# EasyEDA Pro project 示波器_V2.eprj, board PCB1
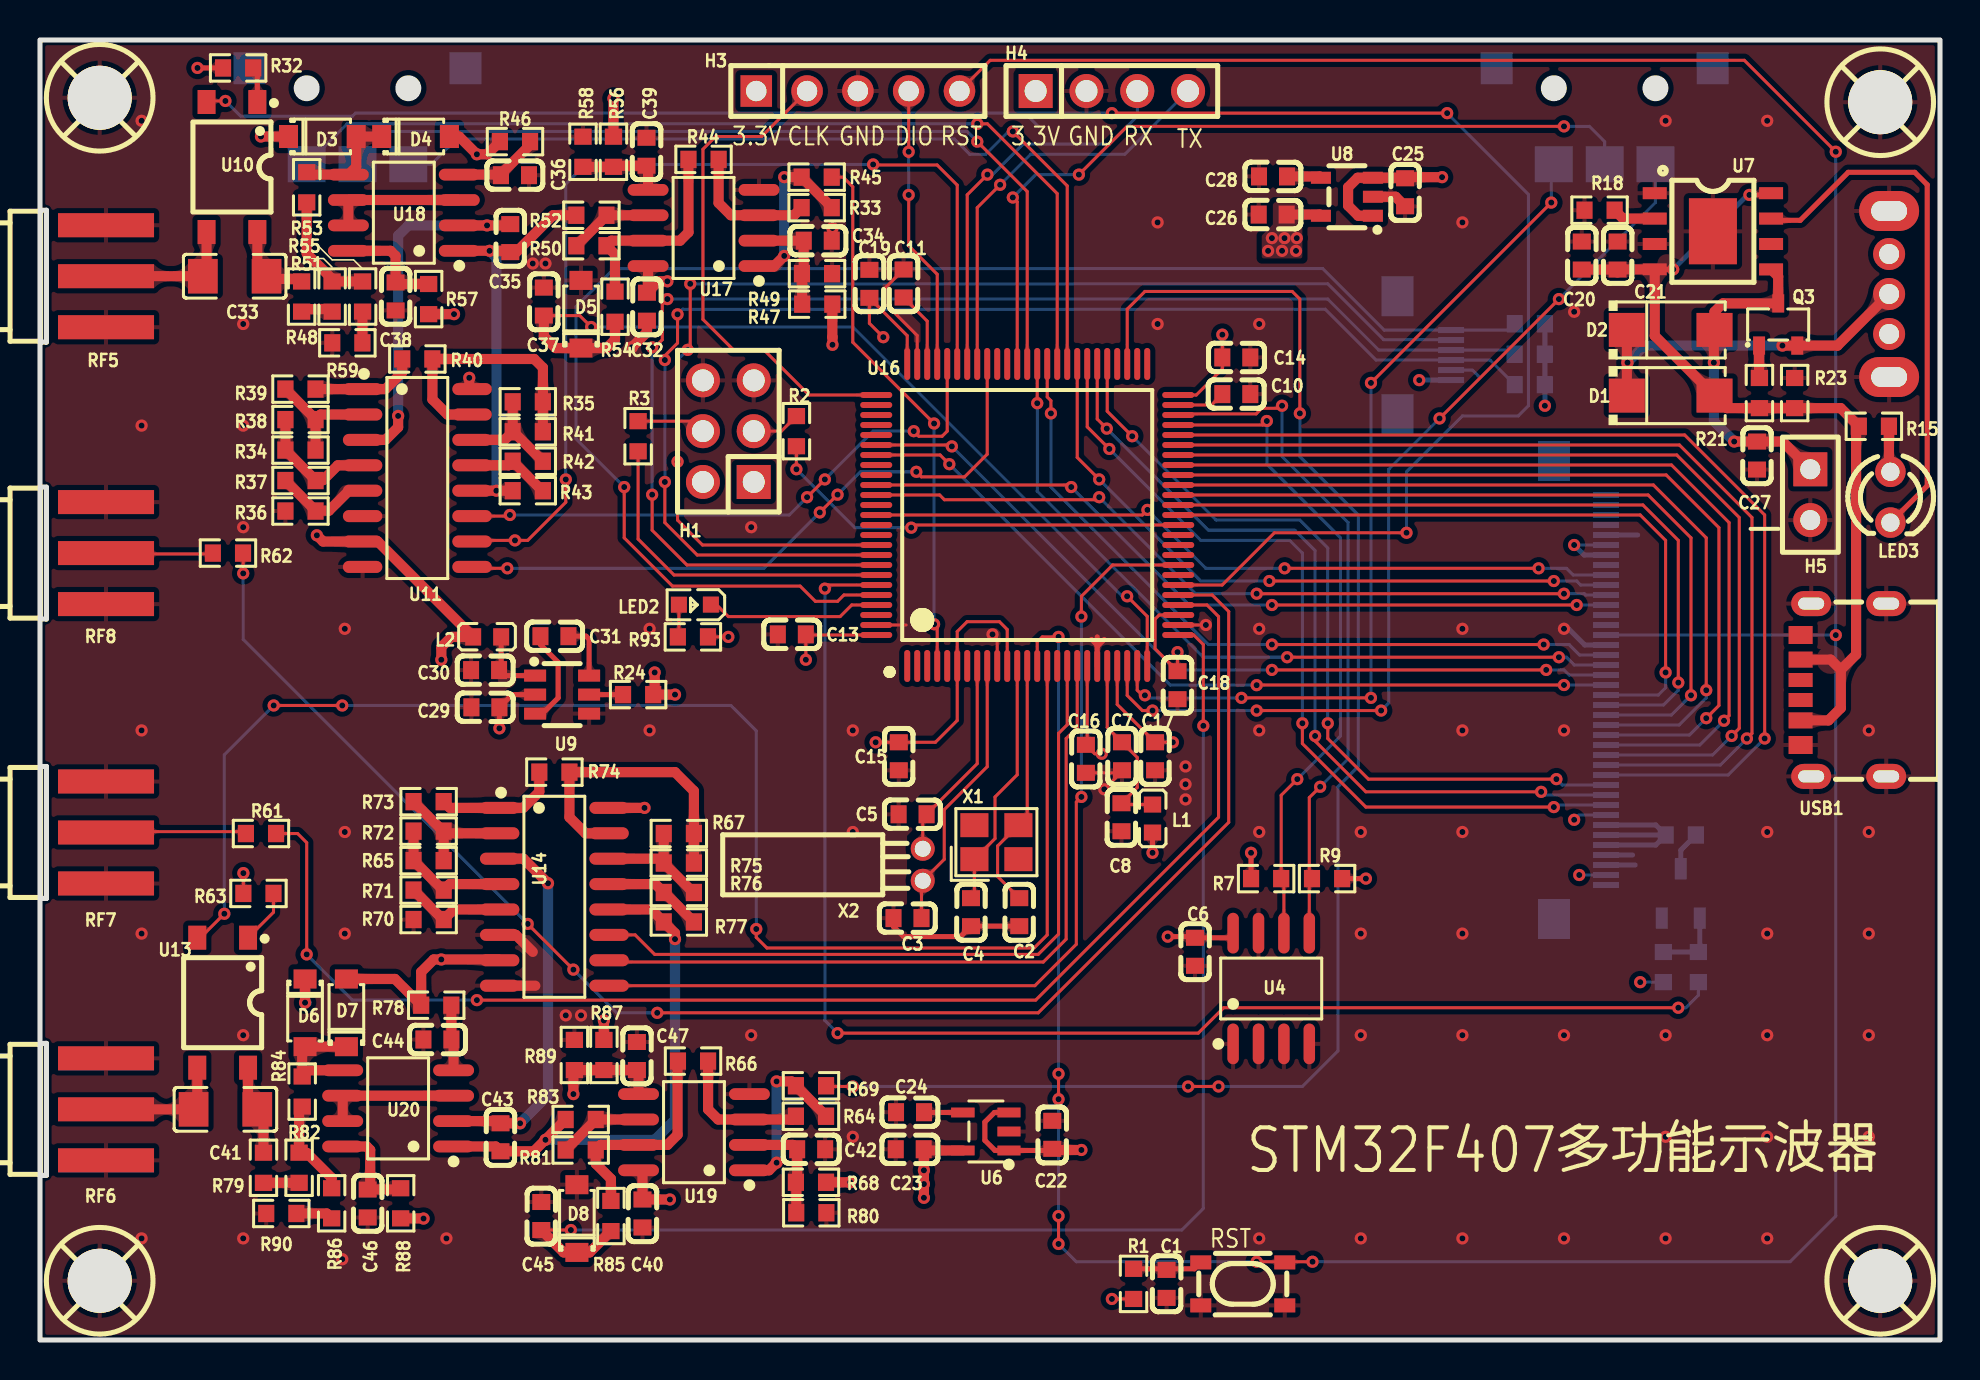
[diagram p4: board, top side]
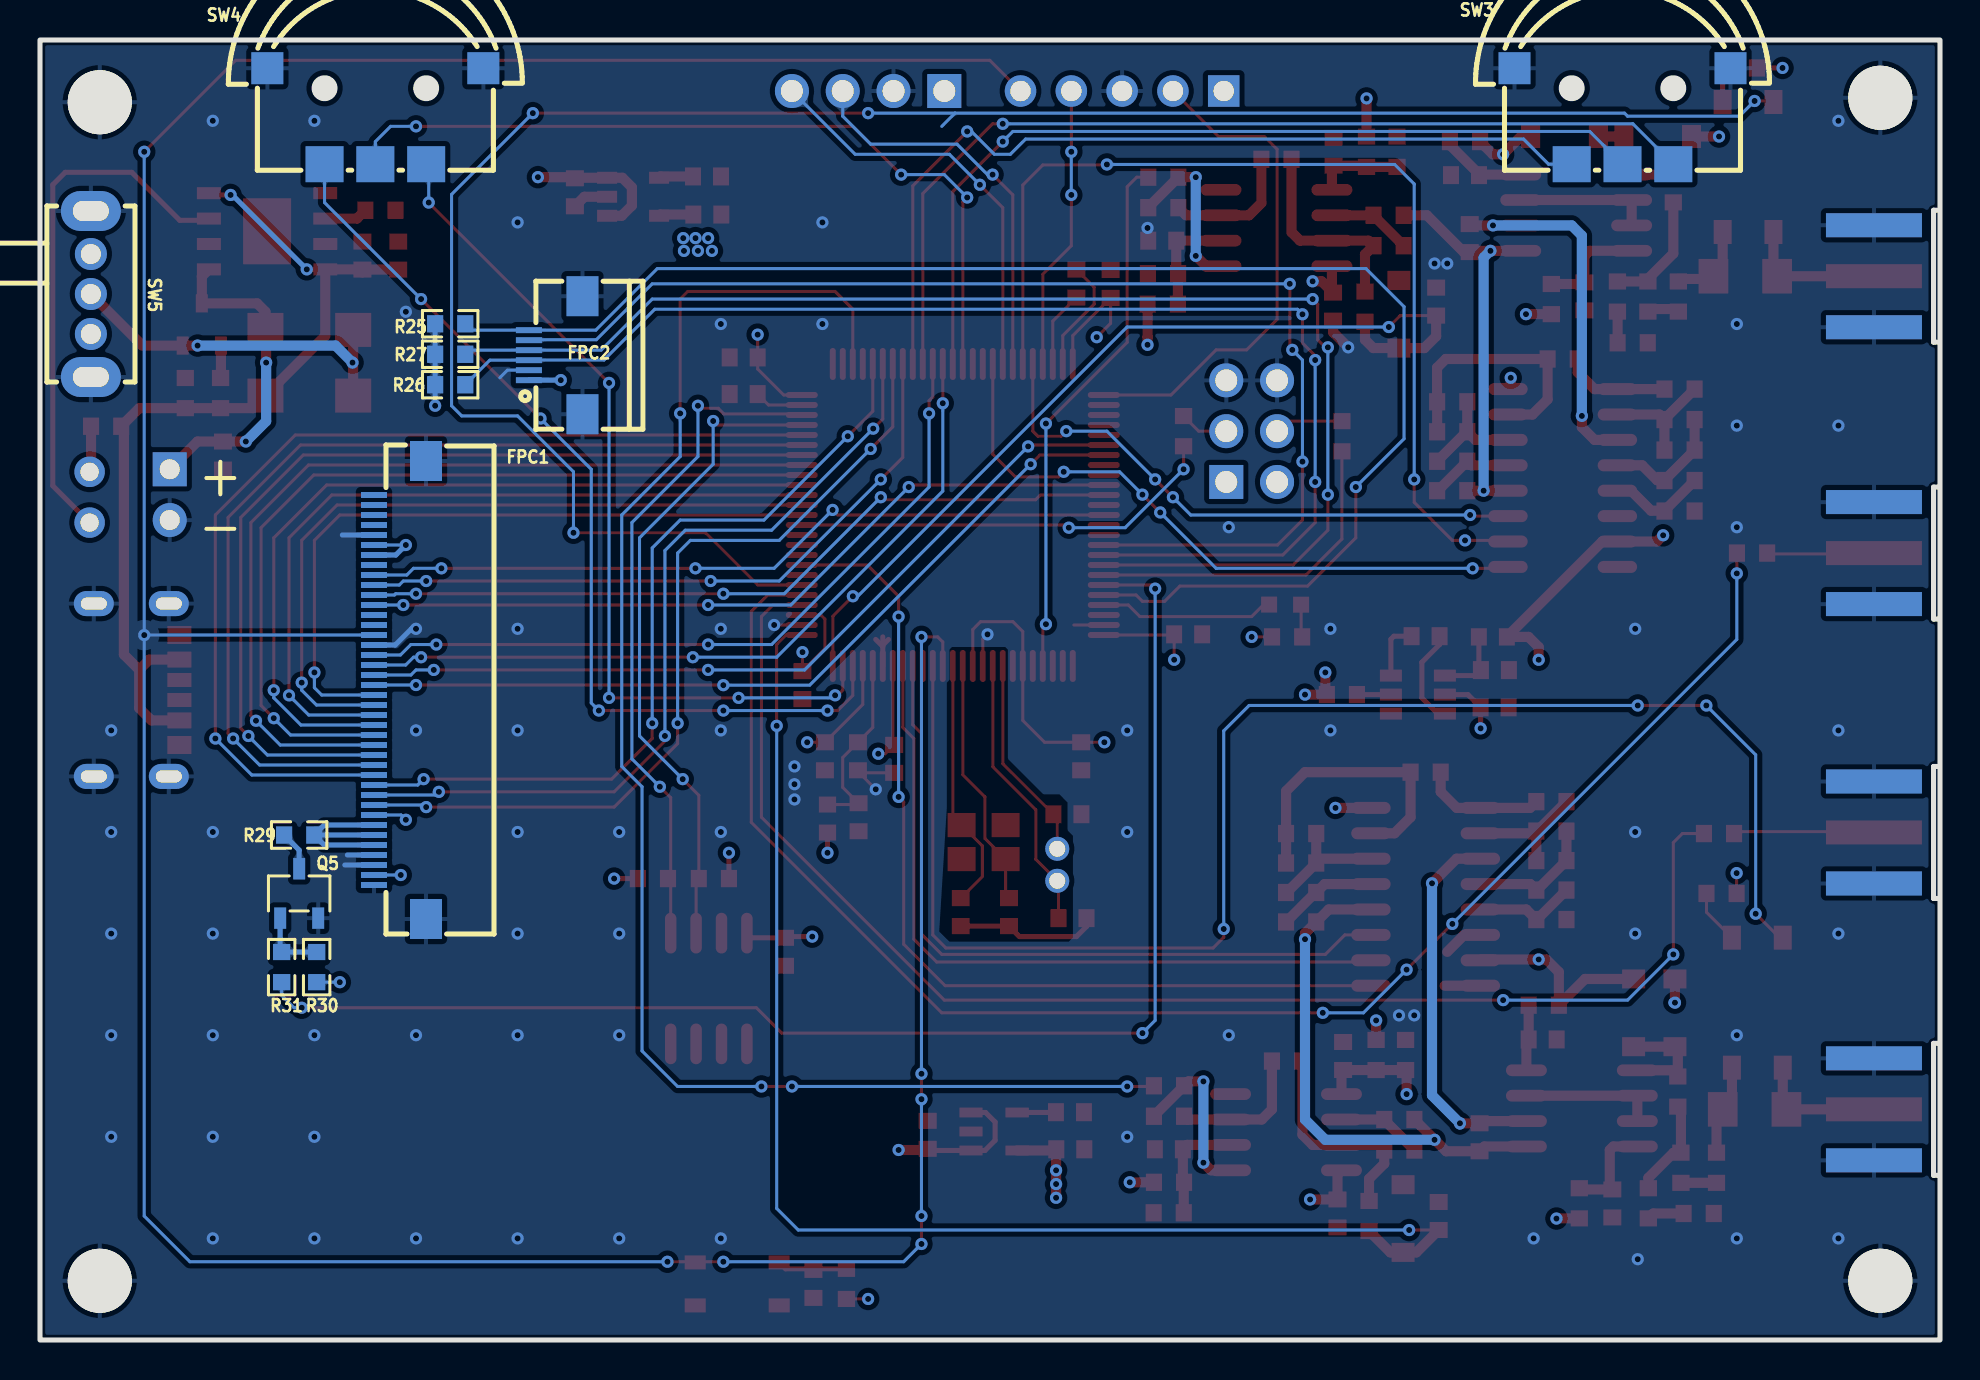
[diagram p5: board, bottom side, seen from below]

Outline 95 x 65 mm; copper layers: Top Layer, Inner1, Inner2, Bottom Layer. Coordinates in mm from the lower left corner of the outline.
Outline path: rectangle 0,65 95,0
Stack: Top Layer 0.035mm 外层铜厚1oz / Dielectric1 0.2104mm 7628 RC49% 8.6mil / Inner1 0.0152mm 内层铜厚 / Dielectric2 1.065mm 1.1mm H/HOZ 含铜 / Inner2 0.0152mm 内层铜厚 / Dielectric3 0.2104mm 7628 RC49% 8.6mil / Bottom Layer 0.035mm 外层铜厚1oz

## Design rules (mm)
spacing copperThickness1oz (default): track to track 0.102, other pairs 0.152 to 0.3
spacing copperThickness2oz: track to track 0.203, other pairs 0.152 to 0.3
spacing Plane_innerPlane: track to track 0.102, other pairs 0.152 to 0.3
spacing Copper_copperRegion: track to track 0.102, other pairs 0.152 to 0.3
spacing Copper_焊盘直接，增加过流能力: track to track 0.102, other pairs 0.152 to 0.3
track width copperThickness1oz (default): min 0.127, default 0.254, max 2.54
track width copperThickness2oz: min 0.203, default 0.254, max 2.54
differential pair differentialPair (default): width min 0.127, default 0.254, max 2.54; gap min 0.152, default 0.152
pour e1357 uses 焊盘直接，增加过流能力

## Placement (name value [footprint] x y rotation side)
C1  100nF  [C0603]  56.33 2.81 270 top
C2  20pF  [C0603]  48.96 21.39 90 top
C3  20pF  [C0603]  43.38 21.09 0 top
C4  20pF  [C0603]  46.55 21.39 90 top
C5  20pF  [C0603]  43.63 26.29 0 top
C6  100nF  [C0603]  57.75 19.41 270 top
C7  100nF  [C0603]  54.1 29.19 90 top
C8  100nF  [C0603]  54.07 26.14 90 top
C10  2.2uF  [C0603]  59.82 47.3 0 top
C11  2.2uF  [C0603]  43.18 52.82 90 top
C13  100nF  [C0603]  37.59 35.28 0 top
C14  100nF  [C0603]  59.82 49.13 180 top
C15  100nF  [C0603]  42.94 29.19 90 top
C16  100nF  [C0603]  52.29 29.06 90 top
C17  100nF  [C0603]  55.75 29.19 90 top
C18  100nF  [C0603]  56.88 32.74 90 top
C19  100nF  [C0603]  41.47 52.81 270 top
C20  10uF  [C0603]  77.09 54.22 270 top
C21  100nF  [C0603]  78.88 54.22 270 top
C22  1nF  [C0603]  50.61 10.26 90 top
C23  1nF  [C0603]  43.49 9.54 180 top
C24  22nF  [C0603]  43.5 11.39 0 top
C25  1uF  [C0603]  68.26 57.39 90 top
C26  1uF  [C0603]  61.63 56.27 180 top
C27  10uF  [C0603]  85.85 44.22 90 top
C28  10nF  [C0603]  61.65 58.18 0 top
C29  3.3uF  [C0603]  22.25 33.49 180 top
C30  3.3uF  [C0603]  22.27 31.63 0 top
C31  3.3uF  [C0603]  25.72 35.19 180 top
C32  100nF  [C0603]  30.35 51.67 90 top
C33  100nF  [C1206]  9.74 53.19 0 top
C34  100nF  [C0603]  38.89 54.97 180 top
C35  22pF  [C0603]  23.51 55.09 90 top
C36  100nF  [C0603]  23.75 58.24 0 top
C37  1nF  [C0603]  25.19 51.92 90 top
C38  100nF  [C0603]  17.78 52.18 270 top
C39  100nF  [C0603]  30.32 59.41 270 top
C40  100nF  [C0603]  30.12 6.33 90 top
C41  100nF  [C1206]  9.27 11.53 0 top
C42  100nF  [C0603]  38.56 9.54 180 top
C43  22pF  [C0603]  23.02 10.14 90 top
C44  100nF  [C0603]  19.87 15.03 180 top
C45  1nF  [C0603]  25.07 6.2 90 top
C46  100nF  [C0603]  16.38 6.83 270 top
C47  100nF  [C0603]  29.84 14.2 270 top
D1  1N5819  [SMA_L4.4-W2.6-LS5.0-RD]  81.53 47.22 0 top
D2  1N5819  [SMA_L4.4-W2.6-LS5.0-RD]  81.53 50.5 0 top
D3  1N4148W  [SOD-123_L2.8-W1.8-LS3.7-RD]  14.12 60.17 0 top
D4  1N4148W  [SOD-123_L2.8-W1.8-LS3.7-RD]  18.78 60.17 0 top
D5  1N4148W  [SOD-123_L2.8-W1.8-LS3.7-RD]  27.05 51.29 90 top
D6  1N4148W  [SOD-123_L2.8-W1.8-LS3.7-RD]  13.25 16.36 270 top
D7  1N4148W  [SOD-123_L2.8-W1.8-LS3.7-RD]  15.32 16.36 90 top
D8  1N4148W  [SOD-123_L2.8-W1.8-LS3.7-RD]  26.84 6.07 90 top
FPC1  AFC01-S40FCA-00  [FPC-SMD_P0.50-40P_FGS-XJ-H2.0]  77 32.5 270 bottom
FPC2  AFC01-S06FCA-00  [FPC-SMD_P0.50-6P_AFC01-S06FCA-00]  69.22 49.24 90 bottom
H1  PZ254V-12-6P  [HDR-TH_6P-P2.54-V-M-R2-C3-S2.54]  34.42 45.44 90 top
H3  -  [HDR-TH_5P-P2.54-V-F]  40.89 62.45 0 top
H4  -  [HDR-TH_4P-P2.54-V-F]  53.59 62.45 0 top
H5  -  [HDR-TH_2P-P2.54-V-F]  88.51 42.27 270 top
L1  GZ1608D601TF  [L0603]  55.63 26.07 270 top
L2  GZ1608D601TF  [L0603]  22.36 35.16 0 top
LED2  -  [LED_0603]  32.69 36.76 180 top
LED3  204-10SURD/S530-A3-L  [LED-TH_BD3.0-P2.54-FD]  92.52 42.14 270 top
Q3  AO3401  [SOT-23-3_L2.9-W1.4-P1.90-LS2.6-BR]  86.91 50.78 270 top
Q5  S8050  [SOT-23-3_L2.9-W1.6-P1.90-LS2.8-BR]  82.04 22.33 270 bottom
R1  10kΩ  [R0603]  54.68 2.81 270 top
R2  10kΩ  [R0603]  37.82 45.44 270 top
R3  10kΩ  [R0603]  29.91 45.19 90 top
R7  4.7kΩ  [R0603]  61.31 23.07 180 top
R9  4.7kΩ  [R0603]  64.35 23.07 0 top
R15  1K  [R0603]  91.69 45.69 180 top
R18  1.2K  [R0603]  77.98 56.49 0 top
R21  10K  [R0603]  85.97 47.35 90 top
R23  10K  [R0603]  87.73 47.35 270 top
R24  10K  [R0603]  29.91 32.27 0 top
R25  4.7kΩ  [R0603]  74.49 50.81 180 bottom
R26  4.7kΩ  [R0603]  74.49 47.76 0 bottom
R27  4.7kΩ  [R0603]  74.49 49.29 180 bottom
R29  10Ω  [R0603]  82.04 25.25 180 bottom
R30  10kΩ  [R0603]  81.17 18.64 270 bottom
R31  1kΩ  [R0603]  82.92 18.64 90 bottom
R32  1K  [R0603]  9.91 63.6 180 top
R33  100K  [R0603]  38.83 56.62 180 top
R34  120Ω  [R0603]  13.02 44.5 0 top
R35  1.2kΩ  [R0603]  24.39 46.91 180 top
R36  20Ω  [R0603]  13.02 41.45 0 top
R37  20Ω  [R0603]  13.02 42.97 0 top
R38  120Ω  [R0603]  13.02 46.02 0 top
R39  100Ω  [R0603]  13.02 47.54 0 top
R40  200Ω  [R0603]  18.87 49.05 0 top
R41  1.2kΩ  [R0603]  24.39 45.41 180 top
R42  1kΩ  [R0603]  24.39 43.94 180 top
R43  2kΩ  [R0603]  24.39 42.46 180 top
R44  1K  [R0603]  33.18 59.03 0 top
R45  200  [R0603]  38.83 58.14 0 top
R46  20Ω  [R0603]  23.75 59.92 0 top
R47  10K  [R0603]  38.86 51.79 0 top
R48  680kΩ  [R0603]  13.08 52.17 90 top
R49  10K  [R0603]  38.85 53.32 180 top
R50  2K  [R0603]  27.57 54.71 0 top
R51  300kΩ  [R0603]  14.61 52.17 270 top
R52  2K  [R0603]  27.57 56.24 0 top
R53  200Ω  [R0603]  13.33 57.63 90 top
R54  200Ω  [R0603]  28.75 51.67 270 top
R55  4K  [R0603]  16.13 52.17 90 top
R56  3kΩ  [R0603]  28.67 59.41 90 top
R57  20Ω  [R0603]  19.43 52.05 270 top
R58  1K  [R0603]  27.15 59.41 270 top
R59  16kΩ  [R0603]  15.37 49.86 0 top
R61  200Ω  [R0603]  11.05 25.32 0 top
R62  200Ω  [R0603]  9.4 39.35 0 top
R63  1K  [R0603]  10.92 22.33 180 top
R64  100K  [R0603]  38.55 11.19 180 top
R65  120Ω  [R0603]  19.43 23.97 0 top
R66  1K  [R0603]  32.65 13.95 0 top
R67  1.2kΩ  [R0603]  31.94 25.32 180 top
R68  10K  [R0603]  38.55 7.89 0 top
R69  200  [R0603]  38.55 12.71 0 top
R70  20Ω  [R0603]  19.43 21.02 0 top
R71  20Ω  [R0603]  19.43 22.5 0 top
R72  120Ω  [R0603]  19.43 25.44 0 top
R73  100Ω  [R0603]  19.43 26.92 0 top
R74  200Ω  [R0603]  25.72 28.39 0 top
R75  1.2kΩ  [R0603]  31.94 23.85 180 top
R76  1kΩ  [R0603]  31.94 22.38 180 top
R77  2kΩ  [R0603]  31.94 20.9 180 top
R78  20Ω  [R0603]  19.81 16.74 0 top
R79  680kΩ  [R0603]  11.17 8.61 90 top
R80  10K  [R0603]  38.56 6.36 180 top
R81  2K  [R0603]  27.03 9.5 0 top
R82  300kΩ  [R0603]  12.95 8.61 270 top
R83  2K  [R0603]  27.03 11.03 0 top
R84  200Ω  [R0603]  13.11 12.42 90 top
R85  200Ω  [R0603]  28.55 6.2 270 top
R86  4K  [R0603]  14.58 6.83 90 top
R87  3kΩ  [R0603]  28.19 14.25 90 top
R88  20Ω  [R0603]  18.03 6.83 270 top
R89  1K  [R0603]  26.72 14.25 270 top
R90  16kΩ  [R0603]  12.06 6.33 0 top
R93  200Ω  [R0603]  32.65 35.16 0 top
RF5  BWSMA-KE-P001  [SMA-SMD_BWSMA-KE-P001]  2.92 53.19 180 top
RF6  BWSMA-KE-P001  [SMA-SMD_BWSMA-KE-P001]  2.92 11.53 180 top
RF7  BWSMA-KE-P001  [SMA-SMD_BWSMA-KE-P001]  2.92 25.38 180 top
RF8  BWSMA-KE-P001  [SMA-SMD_BWSMA-KE-P001]  2.92 39.35 180 top
SW1  SKRPACE010  [KEY-SMD_4P-L4.2-W3.2-P2.20-LS4.6]  60.14 2.81 0 top
SW3  K1-1502SA-01  [KEY-SMD_K1-1502SA-01]  15.88 61.19 180 bottom
SW4  K1-1502SA-01  [KEY-SMD_K1-1502SA-01]  78.23 61.19 180 bottom
SW5  -  [拨动开关_侧]  92.46 52.3 270 bottom
TP1  -  [M3螺丝]  3.05 62.05 0 top
TP2  -  [M3螺丝]  3.05 2.9 0 top
TP3  -  [M3螺丝]  92.07 61.83 0 top
TP4  -  [M3螺丝]  92.07 2.9 0 top
U4  AT24C02  [SOP-8_L5.0-W4.0-P1.27-LS6.0-BL]  61.56 17.57 0 top
U6  RT9193-33GB  [SOT-23-5_L3.0-W1.7-P0.95-LS2.8-BL]  47.3 10.43 90 top
U7  TP4056  [ESOP-8_L4.9-W3.9-P1.27-LS6.0-BL-EP]  83.65 55.44 270 top
U8  RS3236-3.3YF5  [SOT-23-5_L3.0-W1.7-P0.95-LS2.8-BR]  65.35 57.16 0 top
U9  SGM3204YN6G/TR  [SOT-23-6_L2.9-W1.6-P0.95-LS2.8-BR]  26.11 32.27 180 top
U10  KAQY214STLD  [SOP-4_L3.9-W4.4-P2.54-LS7.0-BR]  9.6 58.65 90 top
U11  74HC4051D  [SOIC-16_L9.9-W3.9-P1.27-LS6.0-BL]  18.87 43.1 270 top
U13  KAQY214STLD  [SOP-4_L3.9-W4.4-P2.54-LS7.0-BR]  9.13 16.87 90 top
U14  74HC4051D  [SOIC-16_L9.9-W3.9-P1.27-LS6.0-BL]  25.72 22.16 270 top
U16  STM32F407VET6  [LQFP-100_L14.0-W14.0-P0.50-LS16.0-BL]  49.36 41.25 0 top
U17  TP2604-SR  [SOIC-8_L4.9-W3.9-P1.27-LS6.0-BL]  33.18 55.6 90 top
U18  TP2604-SR  [SOIC-8_L4.9-W3.9-P1.27-LS6.0-BL]  18.19 56.36 90 top
U19  TP2604-SR  [SOIC-8_L4.9-W3.9-P1.27-LS6.0-BL]  32.7 10.39 90 top
U20  TP2604-SR  [SOIC-8_L4.9-W3.9-P1.27-LS6.0-BL]  17.91 11.58 90 top
USB1  U262-061N-4BVC11  [USB-SMD_U262-061N-4BVC11]  90.17 32.5 90 top
X1  8MHz  [CRYSTAL-SMD_4P-L3.2-W2.5-BL]  47.82 24.89 0 top
X2  32.768kHz  [OSC-TH_BD3.1-P0.8-D0.3]  44.14 23.76 0 top

## Footprints (pads in the part's own frame, mm; a bottom-side part is the same pattern mirrored in y, then rotated)
C0603
  rect 0.8x0.9 smd: 1(-0.7,0) 2(0.7,0)
C1206
  rect 1.485x1.728 smd: 1(-1.593,0) 2(1.593,0)
CRYSTAL-SMD_4P-L3.2-W2.5-BL
  rect 1.4x1.2 smd: 1(-1.1,-0.85) 2(1.1,-0.85) 3(1.1,0.85) 4(-1.1,0.85)
ESOP-8_L4.9-W3.9-P1.27-LS6.0-BL-EP
  rect 0.6x1.2 smd: 1(-1.905,-2.909) 2(-0.635,-2.909) 3(0.635,-2.909) 4(1.905,-2.909) 5(1.905,2.909) 6(0.635,2.909) 7(-0.635,2.909) 8(-1.905,2.909)
  rect 3.3x2.4 smd: 9(0,0)
FPC-SMD_P0.50-6P_AFC01-S06FCA-00
  rect 0.3x1.3 smd: 1(-1.248,1.339) 2(-0.748,1.339) 3(-0.248,1.339) 4(0.252,1.339) 5(0.752,1.339) 6(1.252,1.339)
  rect 2x1.6 smd: 7(-2.95,-1.339) 8(2.95,-1.339)
FPC-SMD_P0.50-40P_FGS-XJ-H2.0
  rect 0.3x1.3 smd: 1(-9.75,-1.3) 2(-9.25,-1.3) 3(-8.75,-1.3) 4(-8.25,-1.3) 5(-7.75,-1.3) 6(-7.25,-1.3) 7(-6.75,-1.3) 8(-6.25,-1.3) 9(-5.75,-1.3) 10(-5.25,-1.3) 11(-4.75,-1.3) 12(-4.25,-1.3) 13(-3.75,-1.3) 14(-3.25,-1.3) 15(-2.75,-1.3) 16(-2.25,-1.3) 17(-1.75,-1.3) 18(-1.25,-1.3) 19(-0.75,-1.3) 20(-0.25,-1.3) 21(0.25,-1.3) 22(0.75,-1.3) 23(1.25,-1.3) 24(1.75,-1.3) 25(2.25,-1.3) 26(2.75,-1.3) 27(3.25,-1.3) 28(3.75,-1.3) 29(4.25,-1.3) 30(4.75,-1.3) 31(5.25,-1.3) 32(5.75,-1.3) 33(6.25,-1.3) 34(6.75,-1.3) 35(7.25,-1.3) 36(7.75,-1.3) 37(8.25,-1.3) 38(8.75,-1.3) 39(9.25,-1.3) 40(9.75,-1.3)
  rect 2x1.6 smd: 41(11.45,1.3) 42(-11.45,1.3)
HDR-TH_2P-P2.54-V-F
  rect 1.7x1.7 hole 1: 1(-1.27,0)
  round 1.7 hole 1: 2(1.27,0)
HDR-TH_4P-P2.54-V-F
  rect 1.7x1.7 hole 1.1: 1(-3.81,0)
  round 1.7 hole 1.1: 2(-1.27,0) 3(1.27,0) 4(3.81,0)
HDR-TH_5P-P2.54-V-F
  rect 1.575x1.575 hole 1.02: 1(-5.08,0)
  round 1.575 hole 1.02: 2(-2.54,0) 3(0,0) 4(2.54,0) 5(5.08,0)
HDR-TH_6P-P2.54-V-M-R2-C3-S2.54
  rect 1.7x1.7 hole 1.1: 1(-2.54,-1.27)
  round 1.7 hole 1.1: 2(-2.54,1.27) 3(0,-1.27) 4(0,1.27) 5(2.54,-1.27) 6(2.54,1.27)
KEY-SMD_4P-L4.2-W3.2-P2.20-LS4.6
  rect 1.05x0.7 smd: 1(-2.1,1.075) 2(2.1,1.075) 3(-2.1,-1.075) 4(2.1,-1.075)
KEY-SMD_K1-1502SA-01
  rect 1.9x1.8 smd: 1(-2.54,-2.4) 2(2.54,-2.4) T(0,-2.4)
  rect 1.6x1.6 smd: 5(-5.4,2.4) C(5.4,2.4)
L0603
  rect 0.8x0.864 smd: 1(-0.7,0) 2(0.7,0)
LED-TH_BD3.0-P2.54-FD
  round 1.524 hole 0.914: 1(-1.27,0) 2(1.27,0)
LED_0603
  rect 0.8x0.8 smd: 1(-0.851,-0.01) 2(0.75,-0.005)
LQFP-100_L14.0-W14.0-P0.50-LS16.0-BL
  oval 0.3x1.6 smd: 1(-6,-7.55) 2(-5.5,-7.55) 3(-5,-7.55) 4(-4.5,-7.55) 5(-4,-7.55) 6(-3.5,-7.55) 7(-3,-7.55) 8(-2.5,-7.55) 9(-2,-7.55) 10(-1.5,-7.55) 11(-1,-7.55) 12(-0.5,-7.55) 13(0,-7.55) 14(0.5,-7.55) 15(1,-7.55) 16(1.5,-7.55) 17(2,-7.55) 18(2.5,-7.55) 19(3,-7.55) 20(3.5,-7.55) 21(4,-7.55) 22(4.5,-7.55) 23(5,-7.55) 24(5.5,-7.55) 25(6,-7.55) 51(6,7.55) 52(5.5,7.55) 53(5,7.55) 54(4.5,7.55) 55(4,7.55) 56(3.5,7.55) 57(3,7.55) 58(2.5,7.55) 59(2,7.55) 60(1.5,7.55) 61(1,7.55) 62(0.5,7.55) 63(0,7.55) 64(-0.5,7.55) 65(-1,7.55) 66(-1.5,7.55) 67(-2,7.55) 68(-2.5,7.55) 69(-3,7.55) 70(-3.5,7.55) 71(-4,7.55) 72(-4.5,7.55) 73(-5,7.55) 74(-5.5,7.55) 75(-6,7.55)
  oval 1.6x0.3 smd: 26(7.55,-6) 27(7.55,-5.5) 28(7.55,-5) 29(7.55,-4.5) 30(7.55,-4) 31(7.55,-3.5) 32(7.55,-3) 33(7.55,-2.5) 34(7.55,-2) 35(7.55,-1.5) 36(7.55,-1) 37(7.55,-0.5) 38(7.55,0) 39(7.55,0.5) 40(7.55,1) 41(7.55,1.5) 42(7.55,2) 43(7.55,2.5) 44(7.55,3) 45(7.55,3.5) 46(7.55,4) 47(7.55,4.5) 48(7.55,5) 49(7.55,5.5) 50(7.55,6) 76(-7.55,6) 77(-7.55,5.5) 78(-7.55,5) 79(-7.55,4.5) 80(-7.55,4) 81(-7.55,3.5) 82(-7.55,3) 83(-7.55,2.5) 84(-7.55,2) 85(-7.55,1.5) 86(-7.55,1) 87(-7.55,0.5) 88(-7.55,0) 89(-7.55,-0.5) 90(-7.55,-1) 91(-7.55,-1.5) 92(-7.55,-2) 93(-7.55,-2.5) 94(-7.55,-3) 95(-7.55,-3.5) 96(-7.55,-4) 97(-7.55,-4.5) 98(-7.55,-5) 99(-7.55,-5.5) 100(-7.55,-6)
M3螺丝
  round 3.2 hole 3.2: 1(-0.064,0.064)
OSC-TH_BD3.1-P0.8-D0.3
  round 1.2 hole 0.8: 1(0,0.8) 2(0,-0.8)
R0603
  rect 0.806x0.864 smd: 1(-0.753,0) 2(0.753,0)
SMA-SMD_BWSMA-KE-P001
  rect 4.8x1.2 smd: 1(-0.381,-2.55) 2(-0.381,2.55) 5(-0.381,0)
  rect 4.8x1.2 smd far side: 3(-0.381,2.55) 4(-0.381,-2.55)
SMA_L4.4-W2.6-LS5.0-RD
  rect 1.8x1.7 smd: 1(-2.192,0) 2(2.192,0)
SOD-123_L2.8-W1.8-LS3.7-RD
  rect 0.95x1.15 smd: 1(-1.692,0) 2(1.692,0)
SOIC-8_L4.9-W3.9-P1.27-LS6.0-BL
  oval 0.588x2.045 smd: 1(-1.905,-2.772) 2(-0.635,-2.772) 3(0.635,-2.772) 4(1.905,-2.772) 5(1.905,2.772) 6(0.635,2.772) 7(-0.635,2.772) 8(-1.905,2.772)
SOIC-16_L9.9-W3.9-P1.27-LS6.0-BL
  oval 0.602x1.971 smd: 1(-4.445,-2.736) 2(-3.175,-2.736) 3(-1.905,-2.736) 4(-0.635,-2.736) 5(0.635,-2.736) 6(1.905,-2.736) 7(3.175,-2.736) 8(4.445,-2.736) 9(4.445,2.736) 10(3.175,2.736) 11(1.905,2.736) 12(0.635,2.736) 13(-0.635,2.736) 14(-1.905,2.736) 15(-3.175,2.736) 16(-4.445,2.736)
SOP-4_L3.9-W4.4-P2.54-LS7.0-BR
  rect 1.199x0.9 smd: 1(3.25,-1.27) 2(3.25,1.27) 3(-3.25,1.27) 4(-3.25,-1.27)
SOP-8_L5.0-W4.0-P1.27-LS6.0-BL
  oval 0.574x2.035 smd: 1(-1.905,-2.768) 2(-0.635,-2.768) 3(0.635,-2.768) 4(1.905,-2.768) 5(1.905,2.768) 6(0.635,2.768) 7(-0.635,2.768) 8(-1.905,2.768)
SOT-23-3_L2.9-W1.4-P1.90-LS2.6-BR
  rect 0.91x0.6 smd: 1(1.055,-0.955) 2(1.055,0.955) 3(-1.055,0)
SOT-23-3_L2.9-W1.6-P1.90-LS2.8-BR
  rect 1.07x0.6 smd: 1(1.235,-0.95) 2(1.235,0.95) 3(-1.235,0)
SOT-23-5_L3.0-W1.7-P0.95-LS2.8-BL
  rect 0.49x1.157 smd: 1(-0.95,-1.153) 2(0,-1.153) 3(0.95,-1.153)
  rect 0.49x1.175 smd: 4(0.95,1.153) 5(-0.95,1.153)
SOT-23-5_L3.0-W1.7-P0.95-LS2.8-BR
  rect 1x0.6 smd: 1(1.3,-0.95) 2(1.3,0) 3(1.3,0.95) 4(-1.3,0.95) 5(-1.3,-0.95)
SOT-23-6_L2.9-W1.6-P0.95-LS2.8-BR
  rect 1.1x0.6 smd: 1(1.35,-0.95) 2(1.35,0) 3(1.35,0.95) 4(-1.35,0.95) 5(-1.35,0) 6(-1.35,-0.95)
USB-SMD_U262-061N-4BVC11
  oval 1.25x2 hole 0.6x1.3: 7(-4.32,1.611) 8(4.32,1.611) 9(-4.32,-2.139) 10(4.32,-2.139)
  rect 0.7x1.2 smd: A5(-0.5,2.139) B5(0.5,2.139)
  rect 0.8x1.2 smd: A9(1.52,2.139) B9(-1.52,2.139)
  rect 0.9x1.2 smd: A12(2.75,2.139) B12(-2.75,2.139)
拨动开关_侧
  oval 1.6x1.6 hole 1.001: 1(-1.999,0) 2(0,0) 3(1.999,0)
  oval 1.999x2.999 hole 1.001x1.801: 4(4.151,0) 5(-4.151,0)

## Nets
As in the schematic.

Pads without a net: FPC1 1 2 3 4 8 13 14; SW5 1; U7 6; U16 1 2 3 5 7 16 32 34 35 36 51 52 54 65 66 77 78 79 80 83 84 87 89 90 98; USB1 A5 B5; X1 2 4

## Via types
v1: diameter 0.61, hole 0.305, Top Layer to Bottom Layer, 269 vias

## Routing (per net, layer and track width the routed paths; a pad name or vN(x,y) marks a point on that pad's centre or on a via; arc(x,y) is an arc through that point)
+3.3V: length 63.6
  Top Layer w0.152: 41.81,35.25 38.32,35.25 C13.2 v1(38.29,34.01) ; U16.75 43.36,50.22 C19.2 41.47,50.83 v1(42.16,50.14) ; 48.36,33.7 48.36,35.52 47.97,35.92 46.35,35.92 45.86,35.42 45.86,30.98 44.77,29.89 C15.2 v1(41.78,29.89) ; v1(53.09,29.31) 52.74,29.31 C16.2 52.36,29.83 52.36,33.7 ; v1(56.88,34.39) C18.2 55.75,34.57 55.75,36.04 55.96,36.25 U16.28 ; U16.50 57.82,47.25 59.12,48.55 v1(59.12,50.27) ; v1(80.01,17.89) 80.01,17.88 ; R93.2 v1(34.42,35.16) ; R1.2 v1(53.59,2.05)
  Top Layer w0.254: v1(56.39,20.17) 57.69,20.17 C6.1 59.42,20.11 U4.8 ; L1.2 v1(55.63,24.36) ; R9.2 v1(66.29,23.07) ; R7.2 v1(60.55,24.36)
  Top Layer w0.508: 62.34,56.27 63.99,56.27 U8.5
  Bottom Layer w0.152: v1(38.29,34.01) 38.23,34.01 ; FPC1.39 v1(76.96,23.25) ; FPC1.33 76.95,26.25 v1(76.71,26.01) ; R30.2 v1(80.01,17.89) ; FPC1.6 v1(76.71,39.75)
  Bottom Layer w0.254: FPC2.1 v1(68.96,47.99) ; v1(76.71,39.75) 77.21,39.25 FPC1.7 ; v1(75.24,46.71) R26.2 R27.1 R25.1 ; v1(66.29,23.07) 66.29,23.09
  vias: v1(61.4,54.46) v1(61.59,55.09) v1(62.1,54.46) v1(62.23,55.09) v1(62.84,55.09) v1(62.8,54.46)
+3.3V_A: length 63.1
  Top Layer w0.152: 53.86,33.7 53.86,31.78 C17.2 v1(56.64,29.89) ; R63.2 v1(10.17,23.34)
  Top Layer w0.254: v1(22.97,30.58) C30.2 23.6,32.27 U9.2 ; R32.2 v1(7.87,63.6)
  Top Layer w0.508: v1(31.37,52.94) 30.92,52.94 30.4,52.42 ; v1(44.2,7.11) v1(44.2,7.8) v1(44.2,8.48) 44.2,9.53 ; C23.1 44.2,9.53 ; 44.2,9.53 44.25,9.48 U6.5 ; U19.8 30.12,8.29 C40.2 v1(31.5,7.03) ; R56.2 v1(28.67,62.08) ; v1(39.62,49.76) 39.62,50.14 39.62,50.15 R47.2 ; U11.16 21.46,47.68 v1(21.46,48.11) ; 30.4,52.42 U17.8 ; 30.4,52.42 30.35,52.36 ; R68.2 v1(40.51,7.89) ; v1(19.18,6.07) 19.17,6.08 R88.2 ; U14.16 v1(30.23,26.61) ; R57.2 v1(20.7,51.29) ; v1(31.75,32.27) R24.2 30.73,32.34 v1(30.73,33.38) ; D6.1 v1(13.25,16.87) ; D3.1 v1(11.05,60.17) ; R87.2 v1(28.19,15.98)
  Inner2 w0.152: v1(56.64,29.89) 56.64,23.72 44.2,11.28 v1(44.2,8.48)
  Bottom Layer w0.254: v1(22.97,30.58) 22.99,30.58
  Bottom Layer w0.508: v1(13.25,16.87) 13.33,16.87
-3.3V: length 63
  Top Layer w0.508: U14.7 22.94,19.03 v1(20.07,19.03) 19.69,19.03 19.06,18.4 R78.1 17.75,18.05 D7.2 ; v1(20.07,34.01) 20.07,34.65 20.57,35.16 L2.1 16.89,39.92 U11.7 14.15,39.92 v1(13.84,40.23) ; R46.1 22.36,59.28 v1(21.84,59.28) 20.95,60.17 D4.2
  Inner2 w0.508: v1(13.84,40.23) 13.84,48.74 21.84,56.75 v1(21.84,59.28) ; v1(20.07,19.03) v1(20.07,34.01)
GND: length 39.3
  Top Layer w0.152: v1(47.62,35.28) 47.86,35.05 47.86,33.7 ; v1(58.29,35.75) U16.27 ; 41.81,35.75 43.31,35.75 ; C11.2 42.29,52.63 42.29,51.79 43.86,50.22 U16.74 ; C16.1 53.97,28.36 C7.1 54.1,28.42 v1(53.21,27.53)
  Top Layer w0.254: 52.86,34.75 52.86,35.16 ; 52.86,34.75 52.58,35.03 ; 52.86,34.75 52.86,34.68 ; 52.86,34.68 53.21,35.03 ; 52.86,34.68 52.86,33.7 ; C3.1 42.68,20.67 43.18,20.17 46.03,20.17 C4.1 C2.1
  Top Layer w0.508: v1(29.59,49.63) 30.35,50.39 C32.1 ; C25.1 67.78,57.16 U8.2 ; U14.6 23.79,20.26 24.64,19.41 ; U14.8 24.77,17.72 ; C34.1 39.62,55 v1(39.62,55.6)
  Bottom Layer w0.152: 72.01,48.11 71.62,48.49 FPC2.2
  Bottom Layer w0.254: FPC1.37 79.63,24.25 ; FPC1.16 77.24,34.75 76.43,35.56 v1(76.2,35.56) ; FPC1.38 79.76,23.75 ; FPC1.5 79.88,40.25
  vias: v1(5.08,60.96) v1(5.08,45.72) v1(5.08,30.48) v1(5.08,20.32) v1(5.08,5.08) v1(10.16,50.8) v1(10.16,45.72) v1(10.16,40.64) v1(10.16,15.24) v1(10.16,5.08) v1(15.11,4.04) v1(15.24,35.56) v1(15.24,25.4) v1(15.24,20.32) v1(20.32,5.08) v1(24.64,53.82) v1(25.27,53.82) v1(26.29,16.23) v1(27.05,16.23) v1(30.48,35.56) v1(30.48,30.48) v1(35.56,40.64) v1(35.56,15.24) v1(40.64,30.48) v1(40.64,25.4) v1(40.64,10.16) v1(55.88,55.88) v1(55.88,50.8) v1(57.28,28.68) v1(57.28,27.79) v1(57.28,27.03) v1(60.96,50.8) v1(60.96,35.56) v1(60.96,30.48) v1(60.96,25.4) v1(60.96,5.08) v1(66.04,25.4) v1(66.04,20.32) v1(66.04,15.24) v1(66.04,5.08) v1(71.12,55.88) v1(71.12,35.56) v1(71.12,30.48) v1(71.12,25.4) v1(71.12,20.32) v1(71.12,15.24) v1(71.12,5.08) v1(76.2,30.48) v1(76.2,15.24) v1(76.2,5.08) v1(76.71,51.41) v1(81.28,60.96) v1(81.28,15.24) v1(81.28,10.16) v1(81.28,5.08) v1(86.36,60.96) v1(86.36,25.4) v1(86.36,20.32) v1(86.36,15.24) v1(86.36,10.16) v1(86.36,5.08) v1(91.44,30.48) v1(91.44,25.4) v1(91.44,20.32) v1(91.44,15.24) v1(91.44,10.16)
VBUS: length 45.5
  Top Layer w0.254: 86.55,57.34 86.47,57.25 v1(85.47,57.25) ; U7.4 v1(81.66,53.53)
  Top Layer w0.508: C20.2 78.74,53.52 78.88,53.38 ; 88.03,34.02 89.53,34.02 90.04,33.51 ; 90.04,33.51 90.81,34.27 90.81,45.55 R15.2 90.03,46.59 R23.2 R21.1 84.35,46.59 D1.2 80.74,50.21 U7.4 78.89,53.53 C21.2 ; 90.04,33.51 90.04,31.6 89.42,30.98 88.03,30.98
  Bottom Layer w0.254: v1(85.47,57.25) 85.38,57.25 v1(81.66,53.53)
VCC_IN: length 17.8
  Top Layer w0.508: 79.34,48.87 79.37,48.87 v1(79.38,48.87) ; 79.34,48.87 D1.1 ; 79.34,48.87 D2.1 ; SW5.2 89.88,49.72 Q3.2 v1(87.12,49.72)
  Bottom Layer w0.508: v1(79.38,48.87) 80.22,49.72 v1(87.12,49.72)
VCC_OUT: length 113.4
  Top Layer w0.254: U6.3 47.72,11.38 47.24,10.9 47.24,9.98 47.75,9.48 U6.1 50.53,9.48 C22.1
  Top Layer w0.508: v1(70.1,58.14) 68.31,58.14 C25.2 68.23,58.11 U8.3 65.88,58.11 65.41,57.63 65.41,56.72 65.91,56.21 U8.1 ; C22.1 50.67,9.5 v1(52.07,9.5)
  Inner2 w0.508: v1(70.1,58.14) 73.15,55.09 87.66,55.09 SW5.3 89.31,50.3 86.11,47.09 86.11,41.25 78.49,33.63 78.49,12.55 75.44,9.5 v1(52.07,9.5)
$C1_1: length 3.6
  Top Layer w0.254: 56.28,3.56 C1.1 ; 56.28,3.56 57.72,3.56 SW1.1 ; 56.28,3.56 R1.1
$C7_2: length 9.4
  Top Layer w0.152: 53.36,33.7 53.36,30.63 C7.2 54.86,29.12 54.86,27.63 C8.2 54.14,26.77 L1.1
$C10_1: length 2.4
  Top Layer w0.152: 59.12,47.3 58.57,46.75 U16.49
$C11_1: length 3.8
  Top Layer w0.152: C11.1 44.36,50.94 U16.73
$C24_2: length 1.9
  Top Layer w0.254: U6.4 44.22,11.38 C24.2
$C27_2: length 16.5
  Top Layer w0.508: v1(83.69,48.87) 83.69,50.47 D2.2 83.73,51.41 84.15,51.83 Q3.3 86.91,53.18 U7.5 ; v1(84.71,44.92) C27.2 87.13,44.92 H5.1
  Bottom Layer w0.508: v1(84.71,44.92) 83.69,45.94 v1(83.69,48.87)
$C28_2: length 1.7
  Top Layer w0.508: C28.2 63.98,58.18 U8.4
$C29_1: length 3.6
  Top Layer w0.254: L2.2 23.06,33.6 C29.1 23.23,33.22 U9.1
$C31_1: length 2.9
  Top Layer w0.254: C31.1 27.31,35.19 27.45,35.04 U9.6
$C31_2: length 4.9
  Top Layer w0.254: C31.2 25.02,34.77 25.91,33.89 25.91,32.11 25.12,31.32 U9.3
$C33_1: length 5.7
  Top Layer w0.508: 4.7,53.19 C33.1 8.33,53.37 U10.3
$C33_2: length 4.2
  Top Layer w0.508: U10.4 10.87,53.65 C33.2 11.46,53.05 13.08,53.05
$C34_2: length 5.5
  Top Layer w0.508: 38.11,53.33 R49.2 ; 38.11,53.33 38.19,53.41 C34.2 35.95,54.97 ; 38.11,53.33 R47.1
$C36_1: length 4.4
  Top Layer w0.508: R46.2 24.5,59.75 23.02,58.27 ; U18.4 23.02,58.27 ; 23.02,58.27 C36.1
$C38_1: length 5.5
  Top Layer w0.508: R57.1 17.86,52.8 C38.1 17.78,54.2 17.53,54.46 U18.8
$C39_2: length 4.4
  Top Layer w0.508: R58.2 R56.1 28.73,58.71 C39.2 30.4,58.63 U17.5
$C41_1: length 5.1
  Top Layer w0.508: U13.3 7.86,11.72 C41.1 4.7,11.53
$C41_2: length 4.6
  Top Layer w0.508: R79.2 11.17,11.22 C41.2 10.4,11.99 U13.4
$C42_2: length 5.7
  Top Layer w0.508: 37.81,7.9 R68.1 ; 37.81,7.9 37.86,7.95 C42.2 37.64,9.75 U19.2 ; 37.81,7.9 R80.2
$C44_1: length 3.3
  Top Layer w0.508: R78.2 20.57,16.74 C44.1 20.68,14.91 U20.4
$C46_1: length 5.2
  Top Layer w0.508: U20.8 16.34,9.68 16.51,9.5 16.51,7.65 C46.1 17.97,7.53 R88.1
$C47_2: length 5.6
  Top Layer w0.508: 29.85,13.5 R87.1 R89.2 26.67,13.45 v1(26.67,12.3) ; 29.85,13.5 29.93,13.42 U19.5 ; 29.85,13.5 C47.2
$D3_2: length 5.5
  Top Layer w0.508: R53.2 13.45,58.27 U18.5 15.81,58.66 D3.2 D4.1
$D6_2: length 5.8
  Top Layer w0.508: U20.5 13.42,13.49 R84.2 13.11,14.52 D6.2 D7.1
$H1_3: length 2.4
  Top Layer w0.152: R2.1 37.07,45.44 H1.3
$H1_4: length 3.4
  Top Layer w0.152: R3.2 32.65,45.94 H1.4
$LED2_2: length 1.6
  Top Layer w0.152: 31.94,36.77 31.94,35.21 R93.1
$LED3_1: length 2.3
  Top Layer w0.508: LED3.1 92.45,43.48 R15.1
$LED3_2: length 26.7
  Top Layer w0.254: U7.7 86.64,55.98 88.01,55.98 90.41,58.38 93.74,58.38 94.36,57.76 94.36,42.71 LED3.2
$Q3_1: length 1.6
  Top Layer w0.508: R21.2 85.95,48.12 Q3.1
$Q5_1: length 3.5
  Bottom Layer w0.254: R30.1 R31.2 82.99,19.47 Q5.1
$Q5_3: length 2
  Bottom Layer w0.254: Q5.3 82.04,24.5 R29.1
$R18_2: length 2.2
  Top Layer w0.508: U7.2 79.15,56.07 R18.2
$R24_1: length 1.7
  Top Layer w0.254: U9.5 R24.1
$R32_1: length 1.8
  Top Layer w0.254: R32.1 10.87,63.39 U10.1
$R33_1: length 8.4
  Top Layer w0.508: v1(37.21,58.14) R45.1 39.59,56.64 R33.1 ; 35.95,53.7 36.7,53.7 v1(37.21,54.2)
  Bottom Layer w0.508: v1(37.21,54.2) v1(37.21,58.14)
$R33_2: length 6.7
  Top Layer w0.508: R44.2 33.93,56.85 34.54,56.24 37.7,56.24 R33.2
$R34_1: length 6.3
  Top Layer w0.508: 13.78,42.99 R37.2 ; 13.78,42.99 R34.1 R38.1 ; 13.78,42.99 14.15,42.99 14.89,43.73 U11.4
$R34_2: length 6.1
  Top Layer w0.508: R38.2 13.78,46.04 R39.1 ; R38.2 R34.2 ; R38.2 14.03,46.27 U11.2
$R35_1: length 13.2
  Top Layer w0.508: R41.1 R35.1 25.15,46.91 25.15,48.62 24.71,49.05 R40.2 19.62,47.03 20.38,46.27 U11.15
$R35_2: length 5.8
  Top Layer w0.508: R42.1 23.67,45.41 R41.2 ; U11.14 23.23,45 R41.2 ; R35.2 R41.2
$R36_2: length 4.9
  Top Layer w0.508: R37.1 13.78,41.47 ; 13.78,41.47 14.45,41.47 15.45,42.46 U11.5 ; 13.78,41.47 R36.2
$R39_2: length 5.3
  Top Layer w0.508: R39.2 U11.1 17.27,47.54 18.11,48.39 R40.1
$R44_1: length 10.5
  Top Layer w0.508: R44.1 32.42,55.39 32,54.97 U17.7 28.58,54.97 R50.2 28.75,54.29 R54.1
$R48_1: length 1.5
  Top Layer w0.508: 13.08,51.55 14.61,51.55
$R50_1: length 4.2
  Top Layer w0.508: 30.4,56.24 R52.2 28.32,56.22 R50.1
$R51_1: length 5.9
  Top Layer w0.508: 14.61,53.05 13.33,54.32 R53.1 ; R51.1 R55.2
$R55_1: length 1.6
  Top Layer w0.508: R59.2 16.12,51.41 R55.1
$R61_1: length 5.6
  Top Layer w0.152: R61.1 10.2,25.42 4.7,25.42
$R62_1: length 4
  Top Layer w0.152: R62.1 8.6,39.3 4.7,39.3
$R63_1: length 2.7
  Top Layer w0.152: R63.1 11.68,21.39 U13.1
$R64_1: length 8.8
  Top Layer w0.508: v1(36.83,8.87) 36.45,8.48 U19.1 ; v1(36.83,12.93) 37.58,12.93 R69.1 39.3,11.2 R64.1
  Bottom Layer w0.508: v1(36.83,8.87) v1(36.83,12.93)
$R64_2: length 7.1
  Top Layer w0.508: R66.2 33.4,11.53 33.91,11.03 U19.3 37.63,11.03 R64.2
$R65_1: length 6.5
  Top Layer w0.508: U14.4 20.48,22.8 R71.2 20.15,22.5 R65.1 R72.1
$R65_2: length 6.4
  Top Layer w0.508: R72.2 20.29,25.34 U14.2 ; R72.2 20.15,25.44 R73.1 ; R72.2 R65.2
$R66_1: length 11
  Top Layer w0.508: R85.1 28.55,8.06 27.79,8.81 R81.2 28.04,9.75 U19.7 31.37,9.75 31.88,10.26 31.88,13.92 R66.1
$R67_1: length 14.8
  Top Layer w0.508: U14.15 27.27,25.34 26.47,26.14 R74.2 31.75,28.39 32.69,27.45 32.69,23.85
$R67_2: length 6.4
  Top Layer w0.508: R75.2 32.66,22.38 32.69,22.38 ; R75.2 30.97,24.07 U14.14 ; R75.2 R67.2
$R70_2: length 5.1
  Top Layer w0.508: U14.5 20.69,21.53 R70.2 20.15,21.02 R71.1
$R73_2: length 6.2
  Top Layer w0.508: R73.2 20.5,26.61 U14.1 24.16,26.61 24.97,27.41 R74.1
$R76_2: length 5
  Top Layer w0.508: U14.13 30.77,22.8 R76.2 31.22,22.38 32.69,20.9
$R79_1: length 1.8
  Top Layer w0.508: R79.1 R82.2
$R81_1: length 4.3
  Top Layer w0.508: 26.28,9.5 27.79,11.01 R83.2 U19.6
$R82_1: length 5
  Top Layer w0.508: R84.1 12.95,11.51 R82.1 13.32,9.37 14.58,8.1 R86.2
$R86_1: length 1.9
  Top Layer w0.508: R90.2 14.34,6.33 R86.1
$U18_3: length 6.8
  Top Layer w0.508: U18.3 U18.6 U18.7
$U20_3: length 6.8
  Top Layer w0.508: U20.7 U20.6 U20.3
-INA: length 18.9
  Top Layer w0.508: v1(17.91,46.2) 17.91,45.64 17.27,45 U11.3 ; U18.2 v1(22.35,55.73) 23.45,55.73 C35.2
  Bottom Layer w0.508: v1(17.91,46.2) 17.91,55.22 18.42,55.73 v1(22.35,55.73)
-INA2: length 18.9
  Top Layer w0.508: v1(24,10.84) C43.2 22.91,10.95 U20.2 ; U14.3 24.17,24.07 v1(25.4,22.84)
  Bottom Layer w0.508: v1(25.4,22.84) 25.4,12.23 v1(24,10.84) 24,10.77
AC_IO1: length 102.7
  Top Layer w0.152: v1(68.33,40.36) 61.72,40.36 59.11,37.75 U16.31 ; U10.2 8.38,61.95 v1(9.27,61.95) ; v1(53.59,61.34) v1(70.36,61.34)
  Bottom Layer w0.152: v1(68.33,40.36) 68.33,43.41 71.12,46.2 73.91,46.2 74.42,46.71 74.42,57.28 v1(70.36,61.34) ; 49.25,61.34 v1(53.59,61.34) ; 49.25,61.34 15.77,61.34 15.62,61.19 10.03,61.19 v1(9.27,61.95) ; 49.25,61.34 49.91,60.68
AC_IO2: length 76.8
  Top Layer w0.152: v1(11.68,31.73) v1(15.11,31.73) ; v1(35.81,20.55) 35.81,20.13 36.35,19.6 49.71,19.6 50.36,20.25 50.36,33.7 ; v1(9.22,21.31) 8.02,20.12 U13.2
  Bottom Layer w0.152: v1(15.11,31.73) 34.54,31.73 35.81,30.46 v1(35.81,20.55) ; v1(9.22,21.31) 9.22,29.26 v1(11.68,31.73)
ADC1: length 44.8
  Top Layer w0.152: v1(27.56,50.65) 26.99,51.22 C37.1 ; 55.36,33.7 55.36,36.18 v1(54.36,37.19)
  Top Layer w0.508: R54.2 28.75,50.01 28.33,49.6 D5.1 25.78,49.6 25.19,50.19 C37.1
  Bottom Layer w0.152: v1(27.56,50.65) 40.65,50.65 54.11,37.19 v1(54.36,37.19)
ADC2: length 67.6
  Top Layer w0.152: v1(58.17,30.71) 58.17,34.77 57.69,35.25 U16.26 ; C45.1 v1(26.54,5.5)
  Top Layer w0.508: C45.1 26.19,4.38 D8.1 27.48,4.38 R85.2
  Bottom Layer w0.152: v1(58.17,30.71) 58.17,6.58 57.09,5.5 v1(26.54,5.5)
BOOT0: length 17
  Top Layer w0.152: 41.81,38.25 31.7,38.25 29.91,40.05 R3.1
BOOT1: length 21.5
  Top Layer w0.152: v1(43.56,40.62) 43.7,40.75 U16.37 ; R2.2 v1(37.82,43.54)
  Bottom Layer w0.152: v1(37.82,43.54) 40.74,40.62 v1(43.56,40.62)
CTP_INT: length 61.7
  Top Layer w0.152: 41.81,39.75 33.12,39.75 31.88,41 v1(31.88,43.92) ; v1(32.51,52.81) 32.51,49.63 v1(32.38,49.51)
  Bottom Layer w0.152: v1(32.51,52.81) 64.39,52.81 67.18,50.01 70.53,50.01 FPC2.5 ; v1(31.88,43.92) 31.88,49 v1(32.38,49.51)
CTP_RST: length 75.7
  Top Layer w0.152: 41.81,37.25 40.2,37.25 39.88,36.93 38.77,36.93 38.01,37.69 31.62,37.69 29.21,40.11 v1(29.21,42.65)
  Bottom Layer w0.152: v1(29.21,42.65) 26.8,45.06 26.8,51.67 28.7,53.57 64.13,53.57 67.21,50.49 FPC2.6 73.42,50.49 R25.2
CTP_SCL: length 65.4
  Top Layer w0.152: v1(31.24,42.9) 31.24,40.87 32.86,39.25 41.81,39.25 ; v1(31.24,49) 31.24,49.21 31.88,49.85 v1(31.88,51.28)
  Bottom Layer w0.152: v1(31.24,42.9) v1(31.24,49) ; R26.1 72.51,48.99 FPC2.3 70.55,49 66.8,49 64.26,51.54 32.13,51.54 v1(31.88,51.28)
CTP_SDA: length 67.4
  Top Layer w0.152: 41.81,38.75 32.34,38.75 30.61,40.49 v1(30.61,42.27) ; v1(31.37,52.05) 31.12,51.79 31.12,50.01 30.73,49.63 v1(30.61,49.63)
  Bottom Layer w0.152: R27.2 73.53,49.49 FPC2.4 66.94,49.49 64.39,52.05 v1(31.37,52.05) ; v1(30.61,49.63) v1(30.61,42.27)
DAC_OUT1: length 69.9
  Top Layer w0.152: v1(13.33,19.28) 13.33,24.87 12.88,25.32 R61.2 ; v1(21.84,16.99) 49.78,16.99 58.93,26.14 58.93,36.17 58.35,36.75 U16.29
  Bottom Layer w0.152: v1(21.84,16.99) 15.62,16.99 v1(13.33,19.28)
DAC_OUT2: length 78.7
  Top Layer w0.152: v1(10.16,38.33) 10.16,39.34 R62.2 ; v1(24.38,20.8) v1(26.67,18.52) ; v1(30.86,16.36) 49.91,16.36 59.44,25.88 59.44,36.42 58.61,37.25 U16.30
  Bottom Layer w0.152: v1(10.16,38.33) 10.16,35.03 v1(24.38,20.8) ; v1(30.86,16.36) 28.83,16.36 v1(26.67,18.52)
DB0: length 37.5
  Top Layer w0.152: v1(50.55,46.33) 50.55,46.97 50.36,47.15 U16.61 ; v1(75.18,34.77) v1(61.59,34.77)
  Bottom Layer w0.152: v1(75.18,34.77) 76.45,34.77 76.98,34.25 FPC1.17 ; v1(61.59,34.77) 58.42,34.77 50.55,42.65 v1(50.55,46.33)
DB1: length 38.4
  Top Layer w0.152: v1(75.95,34.14) v1(62.36,34.14) ; U16.62 v1(49.86,46.84)
  Bottom Layer w0.152: v1(49.86,46.84) 49.86,42.44 58.17,34.14 v1(62.36,34.14) ; v1(75.95,34.14) 76.33,34.14 76.72,33.75 FPC1.18
DB2: length 41.3
  Top Layer w0.152: v1(75.31,33.5) v1(61.59,33.5) ; v1(45.59,44.68) 45.52,44.75 41.81,44.75
  Bottom Layer w0.152: v1(61.59,33.5) 56.77,33.5 v1(45.59,44.68) ; v1(75.31,33.5) 76.2,33.5 76.45,33.25 FPC1.19
DB3: length 41.3
  Top Layer w0.152: v1(76.2,32.75) 60.84,32.75 v1(60.83,32.74) ; v1(45.47,43.79) 45.01,44.25 41.81,44.25
  Bottom Layer w0.152: v1(60.83,32.74) 56.51,32.74 v1(45.47,43.79) ; FPC1.20 v1(76.2,32.75)
DB4: length 35.4
  Top Layer w0.152: U16.38 80.01,41.25 81.28,39.98 v1(81.28,33.38)
  Bottom Layer w0.152: FPC1.21 80.91,32.25 81.28,32.61 v1(81.28,33.38)
DB5: length 37.2
  Top Layer w0.152: v1(81.91,32.87) 81.91,39.98 80.15,41.75 U16.39
  Bottom Layer w0.152: FPC1.22 81.18,31.75 81.91,32.49 v1(81.91,32.87)
DB6: length 39.1
  Top Layer w0.152: v1(82.55,32.23) 82.55,40.11 80.41,42.25 U16.40
  Bottom Layer w0.152: FPC1.23 81.57,31.25 v1(82.55,32.23)
DB7: length 41.1
  Top Layer w0.152: v1(83.31,32.49) 83.31,40.11 80.67,42.75 U16.41
  Bottom Layer w0.152: v1(83.31,32.49) 83.31,32.11 81.96,30.75 FPC1.24
DB8: length 43.3
  Top Layer w0.152: v1(83.31,31.09) 83.95,31.73 83.95,40.62 81.31,43.25 U16.42
  Bottom Layer w0.152: v1(83.31,31.09) 82.47,30.25 FPC1.25
DB9: length 45.2
  Top Layer w0.152: v1(84.2,30.96) 84.46,31.22 84.46,40.87 81.57,43.75 U16.43
  Bottom Layer w0.152: FPC1.26 82.99,29.75 v1(84.2,30.96)
DB10: length 47.1
  Top Layer w0.152: U16.44 81.84,44.25 84.96,41.12 84.96,30.58 v1(84.58,30.2)
  Bottom Layer w0.152: FPC1.27 83.63,29.25 v1(84.58,30.2)
DB11: length 48.9
  Top Layer w0.152: U16.45 81.97,44.75 85.6,41.12 85.6,30.33 v1(85.34,30.08)
  Bottom Layer w0.152: v1(85.34,30.08) 84.02,28.75 FPC1.28
DB12: length 50.8
  Top Layer w0.152: v1(86.23,30.08) 86.23,41.25 82.23,45.25 U16.46
  Bottom Layer w0.152: v1(86.23,30.08) 84.41,28.25 FPC1.29
DB13: length 40.6
  Top Layer w0.152: v1(54.61,45.19) 53.36,46.44 U16.55 ; v1(75.82,28.04) 66.42,28.04 64.39,30.08 v1(64.39,30.84)
  Bottom Layer w0.152: v1(64.39,30.84) 64.39,39.6 62.99,41 58.8,41 v1(54.61,45.19) ; FPC1.30 76.11,27.75 v1(75.82,28.04)
DB14: length 41.6
  Top Layer w0.152: v1(75.06,27.41) 66.29,27.41 63.75,29.95 v1(63.75,30.2) ; U16.56 52.86,46.05 v1(53.34,45.57)
  Bottom Layer w0.152: v1(53.34,45.57) 58.42,40.49 62.74,40.49 63.75,39.47 v1(63.75,30.2) ; FPC1.31 75.22,27.25 v1(75.06,27.41)
DB15: length 42.6
  Top Layer w0.152: U16.57 52.36,45.66 v1(53.47,44.55) ; v1(63.12,30.84) 63.12,29.82 66.29,26.65 v1(75.69,26.65)
  Bottom Layer w0.152: FPC1.32 75.8,26.75 v1(75.69,26.65) ; v1(53.47,44.55) 58.04,39.98 62.48,39.98 63.12,39.35 v1(63.12,30.84)
EC11A1: length 44.3
  Top Layer w0.152: v1(48.64,60.43) 51.36,57.71 U16.59
  Bottom Layer w0.152: SW3.1 19.57,58.79 20.83,60.05 45.72,60.05 46.48,59.28 47.28,59.28 48.43,60.43 v1(48.64,60.43)
EC11A2: length 47.5
  Top Layer w0.152: 54.36,33.7 54.36,32.23 55.12,31.47 v1(55.63,31.47) ; v1(69.98,46.08) v1(75.95,52.05) ; v1(67.06,31.47) v1(60.83,31.47)
  Bottom Layer w0.152: v1(69.98,46.08) 67.44,43.54 67.44,31.85 v1(67.06,31.47) ; SW4.1 80.77,56.87 v1(75.95,52.05) ; v1(55.63,31.47) v1(60.83,31.47)
EC11B1: length 48.3
  Top Layer w0.152: v1(46.86,60.81) 47.37,60.81 50.86,57.32 U16.60
  Bottom Layer w0.152: SW3.2 15.35,60.81 v1(46.86,60.81)
EC11B2: length 43.5
  Top Layer w0.152: v1(60.07,32.11) v1(66.55,32.11) ; v1(55.25,32.23) 55.12,32.23 54.86,32.49 54.86,33.7 ; v1(66.55,47.86) v1(75.56,56.87)
  Bottom Layer w0.152: v1(55.25,32.23) 55.37,32.11 v1(60.07,32.11) ; v1(66.55,32.11) v1(66.55,47.86) ; v1(75.56,56.87) 75.56,58.66 SW4.2
FREQ_C1: length 27
  Top Layer w0.152: 44.86,33.7 44.86,35.63 v1(44.7,35.79) ; R45.2 40.16,58.14 40.64,57.66 40.64,49.89 v1(44.7,45.82)
  Bottom Layer w0.152: v1(44.7,45.82) v1(44.7,35.79)
FREQ_C2: length 77.5
  Top Layer w0.152: R69.2 39.34,12.68 v1(40.64,12.68) ; v1(62.99,46.33) 62.99,52.05 62.61,52.43 55.25,52.43 54.36,51.54 U16.53 ; v1(58.93,12.68) v1(57.4,12.68)
  Bottom Layer w0.152: v1(57.4,12.68) v1(40.64,12.68) ; v1(58.93,12.68) 63.12,12.68 64.9,14.45 64.9,27.66 65.91,28.68 65.91,41.25 62.99,44.17 v1(62.99,46.33)
FSMC_A16: length 33.8
  Top Layer w0.152: v1(52.96,43.03) 51.86,44.13 U16.58 ; v1(75.69,37.95) v1(61.47,37.95)
  Bottom Layer w0.152: v1(61.47,37.95) 58.04,37.95 v1(52.96,43.03) ; FPC1.10 77.03,37.75 76.84,37.95 v1(75.69,37.95)
FSMC_NE1: length 37.9
  Top Layer w0.152: v1(55.37,41.5) 55.12,41.25 41.81,41.25 ; v1(74.93,38.58) v1(62.23,38.58)
  Bottom Layer w0.152: FPC1.9 76.66,38.25 76.33,38.58 v1(74.93,38.58) ; v1(55.37,41.5) 58.29,38.58 v1(62.23,38.58)
FSMC_NOE: length 39
  Top Layer w0.152: v1(51.56,42.65) 51.46,42.75 41.81,42.75 ; v1(76.84,36.75) v1(61.59,36.75)
  Bottom Layer w0.152: FPC1.12 v1(76.84,36.75) ; v1(51.56,42.65) 57.46,36.75 v1(61.59,36.75)
FSMC_NWR: length 38.7
  Top Layer w0.152: v1(76.2,37.31) v1(60.83,37.31) ; 41.81,42.25 44.98,42.25 45.22,42.01 52.83,42.01 v1(52.96,42.14)
  Bottom Layer w0.152: v1(76.2,37.31) 77.22,37.31 77.28,37.25 FPC1.11 ; v1(52.96,42.14) 57.78,37.31 v1(60.83,37.31)
HC1_0: length 29.1
  Top Layer w0.152: v1(43.69,45.44) 43.94,45.19 45.11,45.19 45.36,45.44 U16.71 ; v1(23.5,41.25) 23.44,41.19 U11.11 ; v1(39.24,43.03) v1(38.35,42.14)
  Bottom Layer w0.152: v1(38.35,42.14) 37.47,41.25 v1(23.5,41.25) ; v1(43.69,45.44) 41.66,45.44 v1(39.24,43.03)
HC1_1: length 50.9
  Top Layer w0.152: v1(41.66,58.78) 41.68,58.75 44.86,58.75 45.86,57.75 U16.70 ; U11.10 21.55,39.98 v1(23.75,39.98) 24.38,39.98 26.29,41.89 v1(26.29,43.03)
  Bottom Layer w0.152: v1(41.66,58.78) 27.27,58.78 26.29,57.8 v1(26.29,43.03)
HC1_2: length 32.9
  Top Layer w0.152: U16.67 47.36,44.29 46.23,43.16 44.07,43.16 v1(43.81,43.41) ; v1(23.37,38.58) 21.67,38.58 U11.9 ; v1(39.88,42.27) v1(38.99,41.38)
  Bottom Layer w0.152: v1(23.37,38.58) 36.19,38.58 v1(38.99,41.38) ; v1(43.81,43.41) 41.02,43.41 v1(39.88,42.27)
HC2_0: length 36.9
  Top Layer w0.152: 51.36,33.7 51.36,30.76 50.93,30.33 50.93,20.3 49.91,19.28 30.73,19.28 29.76,20.26 U14.11
HC2_1: length 37.3
  Top Layer w0.152: 51.86,33.7 51.86,30.63 51.31,30.08 51.31,20.04 50.16,18.9 28.54,18.9 U14.10
HC2_2: length 47.2
  Top Layer w0.152: v1(52.07,27.15) 51.82,26.9 51.82,19.79 49.74,17.72 U14.9 ; v1(52.07,36.17) 52.07,37.19 53.63,38.75 U16.33
  Bottom Layer w0.152: v1(52.07,27.15) v1(52.07,36.17)
I2C2_SCL: length 32.9
  Top Layer w0.152: v1(61.34,45.95) 61.14,45.75 U16.47 ; U4.6 62.19,22.93 R7.1 62.06,27.24 v1(62.87,28.04)
  Bottom Layer w0.152: v1(61.34,45.95) 61.34,43.79 65.02,40.11 65.02,30.2 v1(62.87,28.04)
I2C2_SDA: length 34.1
  Top Layer w0.152: 63.47,22.93 R9.1 ; 63.47,22.93 U4.5 ; 63.47,22.93 63.47,27.12 v1(64.01,27.66) ; U16.48 56.97,46.31 60.81,46.31 61.09,46.58 61.98,46.58 v1(62.1,46.71)
  Bottom Layer w0.152: v1(62.1,46.71) 62.1,44.17 65.41,40.87 65.41,29.06 v1(64.01,27.66)
KEY1: length 44
  Top Layer w0.152: U16.63 49.36,57.42 v1(46.86,59.92)
  Bottom Layer w0.152: v1(46.86,59.92) 46.35,60.43 17.51,60.43 SW3.T
KEY2: length 40.9
  Top Layer w0.152: v1(51.94,58.27) 54.36,60.68 v1(76.2,60.68) ; v1(48.64,57.13) 48.86,56.91 U16.64
  Bottom Layer w0.152: v1(51.94,58.27) 49.78,58.27 v1(48.64,57.13) ; v1(76.2,60.68) 77.47,60.68 78.23,59.92 SW4.T
LED: length 8.8
  Top Layer w0.152: LED2.1 33.82,36.77 34.42,36.17 40,36.17 40.59,36.75 41.81,36.75
LEDK: length 9.4
  Bottom Layer w0.254: FPC1.35 81.29,25.25 ; FPC1.34 80.79,25.75 R29.2 80.79,24.75 FPC1.36
OSC32_IN: length 10.3
  Top Layer w0.152: X2.1 44.14,26.1 C5.2 46.86,28.82 46.86,33.7
OSC32_OUT: length 14
  Top Layer w0.152: C3.2 44.07,22.9 X2.2 45.21,24.04 45.21,26.52 47.36,28.67 47.36,33.7
OSC_IN: length 12.6
  Top Layer w0.152: C4.2 46.72,22.26 X1.1 47.75,25.07 47.75,27.15 48.86,28.26 48.86,33.7
OSC_OUT: length 12.7
  Top Layer w0.152: 49.36,33.7 49.36,26.18 X1.3 47.88,24.7 47.88,23.18 C2.2
OUTA: length 20.8
  Top Layer w0.508: U11.12 v1(22.82,42.46) R43.2 ; U18.1 v1(22.48,54.46) 23.45,54.46 C35.1 23.81,54.39 25.65,56.24 R52.1
  Bottom Layer w0.508: v1(22.82,42.46) 22.82,54.12 v1(22.48,54.46)
OUTA2: length 26.4
  Top Layer w0.508: 25.27,10.01 24.69,9.44 C43.1 22.78,9.68 U20.1 ; 25.27,10.01 v1(25.27,10.01) ; 25.27,10.01 26.28,11.03 ; v1(31.75,20.04) 31.75,20.34 R77.2 30.56,21.53 U14.12
  Bottom Layer w0.508: v1(31.75,20.04) 31.75,11.03 30.73,10.01 v1(25.27,10.01)
RST: length 184
  Top Layer w0.152: v1(50.93,13.31) v1(50.93,12.04) ; H3.5 47.51,63.98 85.22,63.98 v1(89.79,59.41) ; v1(50.93,35.16) 50.12,35.16 49.86,34.9 49.86,33.7 ; v1(63.63,3.91) 62.27,3.91 SW1.2 62.21,3.91 v1(60.83,3.91) ; v1(50.93,6.2) v1(50.93,4.8)
  Bottom Layer w0.152: v1(60.83,3.91) 51.82,3.91 v1(50.93,4.8) ; FPC1.15 89.78,35.25 v1(89.79,35.25) ; v1(50.93,35.16) v1(50.93,13.31) ; v1(50.93,12.04) v1(50.93,6.2) ; v1(89.79,35.25) 89.79,6.2 87.5,3.91 v1(63.63,3.91) ; v1(89.79,35.25) v1(89.79,59.41)
RX1: length 19.8
  Top Layer w0.152: v1(47.37,58.27) 46.36,57.26 U16.69
  Bottom Layer w0.152: H4.3 54.86,61.19 53.47,59.79 49.15,59.79 47.62,58.27 v1(47.37,58.27)
SWCLK: length 25.2
  Top Layer w0.152: H3.2 36.08,60.17 33.78,60.17 33.15,59.54 33.15,51.03 34.67,49.51 36.19,49.51 38.45,47.25 41.81,47.25
SWDIO: length 14.5
  Top Layer w0.152: U16.72 44.86,53.29 43.43,54.71 v1(43.43,57.25) ; H3.4 v1(43.43,59.41) 43.43,59.16
  Bottom Layer w0.152: v1(43.43,59.41) v1(43.43,57.25)
TFT_BL: length 69.6
  Top Layer w0.152: v1(39.88,15.34) 57.91,15.34 59.18,16.61 v1(81.91,16.61) ; 41.81,37.75 39.43,37.75 v1(39.24,37.57)
  Bottom Layer w0.152: v1(81.91,16.61) 82.3,16.61 82.92,17.23 R31.1 ; v1(39.88,15.34) 39.24,15.98 v1(39.24,37.57)
TX1: length 20.8
  Top Layer w0.152: v1(48.01,57.76) 46.86,56.62 U16.68
  Bottom Layer w0.152: H4.4 54.24,59.28 49.53,59.28 v1(48.01,57.76)
Y0: length 4.2
  Top Layer w0.508: U11.13 23.43,43.73 R42.2 25.11,42.46 R43.1

## Copper pours and planes (outline as drawn; the poured copper is in the pictures)
+3.3V on Top Layer: 61.64,56.79 61.64,55.78 61.09,55.22 61.09,54.08 63.12,54.08 63.12,56.89 61.74,56.89 61.64,56.79
+3.3V on Inner2: 29.73,65 38.11,56.62 40.51,56.62 42.46,54.67 42.46,51.33 40,48.87 31.72,48.87 30.17,47.31 30.17,35.85 34.93,31.09 34.93,20.34 41.45,13.82 46.15,13.82 49.4,10.57 49.4,0 95,0 95,65
+3.3V_A on Inner2: 0,65 28.96,65 37.85,56.11 40.39,56.11 42.06,54.44 42.06,51.52 39.79,49.25 31.51,49.25 29.72,47.46 29.72,35.66 34.54,30.84 34.54,20.1 41.21,13.44 45.97,13.44 49.09,10.32 49.09,0 0,0
GND on Top Layer: 0,65 95,65 95,0 0,0
GND on Bottom Layer: 0,65 95,65 95,0 0,0
GND on Inner1: 0,65 95,65 95,0 0,0

Small or netless copper shapes (teardrops, artwork), in the pictures only: 622 on Top Layer, 207 on Bottom Layer, 4 on Inner2

## Text on the board
Bottom Silkscreen Layer: + | -
Top Silkscreen Layer: 3.3V | CLK | GND | DIO | RST | RX | TX | - | STM32F407多功能示波器
